# EAGLE schematic schematic (EAGLE 9.3.0)
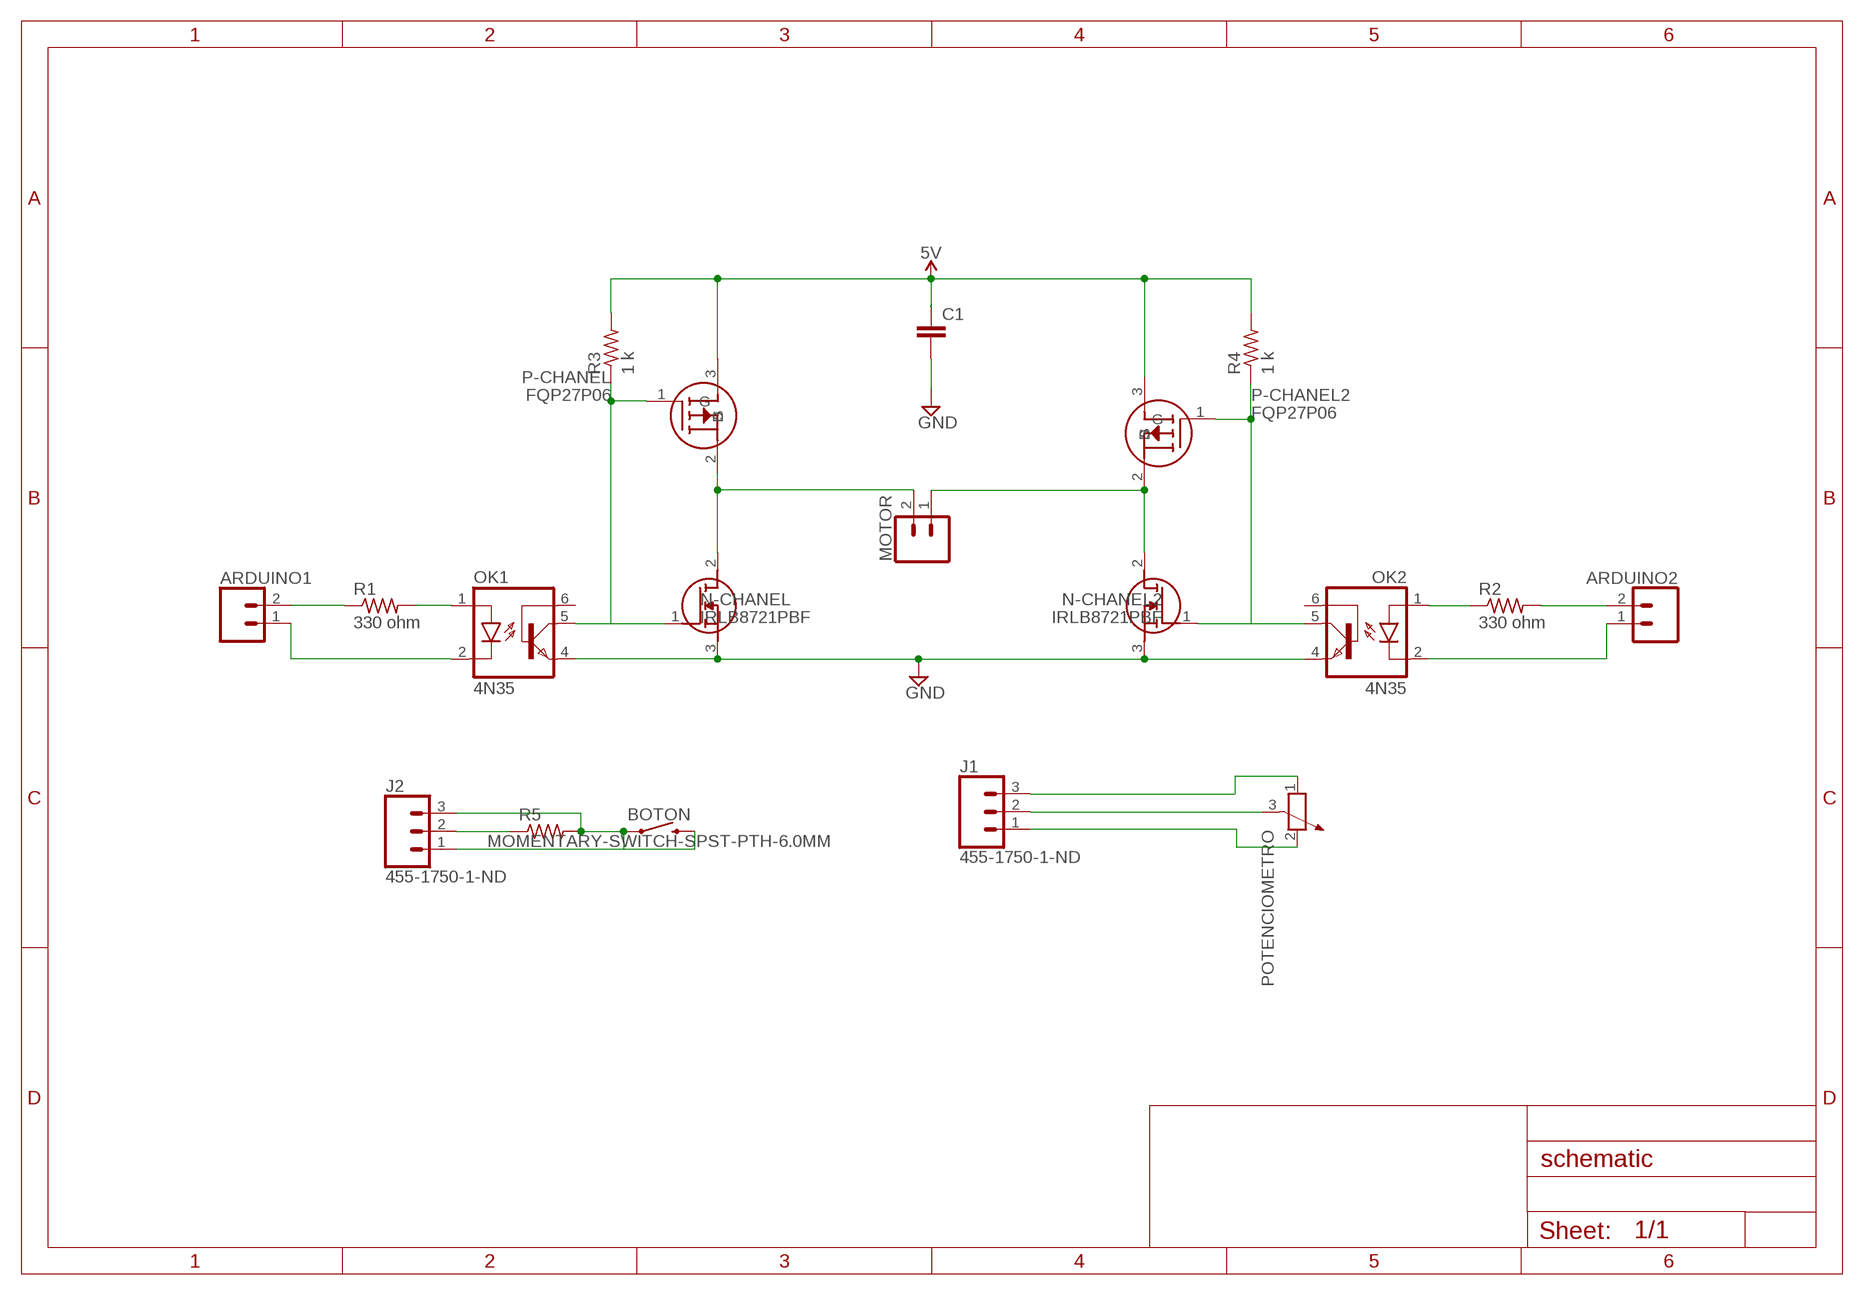
[diagram p0: schematic, sheet 1]

## Parts
ARDUINO1  CONN_02  [1X02]
ARDUINO2  CONN_02  [1X02]
BOTON  MOMENTARY-SWITCH-SPST-PTH-6.0MM  [TACTILE_SWITCH_PTH_6.0MM]
C1  C-EUC0805  [C0805]
J1  455-1750-1-ND  CONN_03  [1X03]
J2  455-1750-1-ND  CONN_03  [1X03]
MOTOR  CONN_02  [1X02]
N-CHANEL  IRLB8721PBF  [TO254P483X1016X1994-3P]
N-CHANEL2  IRLB8721PBF  [TO254P483X1016X1994-3P]
OK1  4N35  [DIL06]
OK2  4N35  [DIL06]
P-CHANEL  FQP27P06  [TO220]
P-CHANEL2  FQP27P06  [TO220]
POTENCIOMETRO  POTENTIOMETER_PT-10S  [PT-10S]
R1  330 ohm  R-US_0411/12  [0411/12]
R2  330 ohm  R-US_0411/12  [0411/12]
R3  1 k  R-US_0411/12  [0411/12]
R4  1 k  R-US_0411/12  [0411/12]
R5  R-US_0411/12  [0411/12]

## Nets
5V: C1.1 P-CHANEL2.3(S) P-CHANEL.3(S) R3.2 R4.2
GND: C1.2 N-CHANEL2.3(S) N-CHANEL.3(S) OK1.4(EMI) OK2.4(EMI)
N$1: MOTOR.2 N-CHANEL.2(D) P-CHANEL.2(D)
N$2: MOTOR.1 N-CHANEL2.2(D) P-CHANEL2.2(D)
N$3: N-CHANEL2.1(G) OK2.5(COL) P-CHANEL2.1(G) R4.1
N$4: OK1.1(A) R1.2
N$5: N-CHANEL.1(G) OK1.5(COL) P-CHANEL.1(G) R3.1
N$6: ARDUINO1.2 R1.1
N$7: ARDUINO1.1 OK1.2(C)
N$8: OK2.1(A) R2.1
N$9: ARDUINO2.2 R2.2
N$10: ARDUINO2.1 OK2.2(C)
N$11: J2.2 R5.1
N$12: J1.3 POTENCIOMETRO.1
N$13: J1.2 POTENCIOMETRO.3
N$14: J1.1 POTENCIOMETRO.2
N$15: BOTON.1 J2.3 R5.2
N$16: BOTON.3 J2.1
Unconnected: OK1.6(BAS) OK2.6(BAS)

## Library data of the parts
ARDUINO1 ARDUINO2 MOTOR = SparkFun-Connectors:CONN_02: Multi connection point. Often used as Generic Header-pin footprint for 0.1 inch spaced/style header connections On any of the 0.1 inch spaced packages, you can populate with these: Break Away Headers - Straight <https://www.sparkfun.com/products/116> (PRT-00116) Break Away Male Headers - Right Angle <https://www.sparkfun.com/products/553> (PRT-00553) Female Headers <https://www.sparkfun.com/products/115> (PRT-00115) Break Away Headers - Machine Pin <https://www.sparkfun.com/products/117> (PRT-00117) Break Away Female Headers - Swiss Machine Pin <https://www.sparkfun.com/products/743> (PRT-00743) For SCREWTERMINALS and SPRING TERMINALS visit here: Screw Terimnals on SparkFun.com <https://www.sparkfun.com/search/results?term=Screw+Terminals> (5mm/3.5mm/2.54mm spacing) This device is also useful as a general connection point to wire up your design to another part of your project. Our various solder wires solder well into these plated through hole pads. Hook-Up Wire - Assortment (Stranded, 22 AWG) <https://www.sparkfun.com/products/11375> (PRT-11375) Hook-Up Wire - Assortment (Solid Core, 22 AWG) <https://www.sparkfun.com/products/11367> (PRT-11367) View the entire wire category on our website here <https://www.sparkfun.com/categories/141> Special notes: Molex polarized connector foot print use with: PRT-08233 with associated crimp pins and housings. 2.54_SCREWTERM for use with PRT-10571. 3.5mm Screw Terminal footprints for PRT-08084 5mm Screw Terminal footprints for use with PRT-08432
BOTON = SparkFun-Switches:MOMENTARY-SWITCH-SPST: Momentary Switch (Pushbutton) - SPST Normally-open (NO) SPST momentary switches (buttons, pushbuttons). Variants PTH-12MM - 12mm square, through-hole Momentary Pushbutton Switch - 12mm Square <https://www.sparkfun.com/products/9190> (COM-09190) PTH-6.0MM, PTH-6.0MM-KIT - 6.0mm square, through-hole Mini Pushbutton Switch <https://www.sparkfun.com/products/97> (COM-00097) KIT package intended for soldering kit's - only one side of pads' copper is exposed. PTH-RIGHT-ANGLE-KIT - Right-angle, through-hole Right Angle Tactile Button <https://www.sparkfun.com/products/10791> - Used on SparkFun BigTime Watch Kit <https://www.sparkfun.com/products/11734> SMD-12MM - 12mm square, surface-mount Tactile Button - SMD (12mm) <https://www.sparkfun.com/products/12993> (COM-12993) Used on SparkFun PicoBoard <https://www.sparkfun.com/products/11888> SMD-4.5MM - 4.5mm Square Trackball Switch Used on SparkFun Blackberry Trackballer Breakout <https://www.sparkfun.com/products/13169> SMD-4.6MMX2.8MM - 4.60mm x 2.80mm, surface mount Used on SparkFun SAMD21 Mini Breakout <https://www.sparkfun.com/products/13664> SMD-5.2MM, SMD-5.2-REDUNDANT - 5.2mm square, surface-mount Mini Pushbutton Switch - SMD <https://www.sparkfun.com/products/8720> (COM-08720) Used on Arduino Pro Mini <https://www.sparkfun.com/products/11114> REDUNDANT package connects both switch circuits together SMD-6.0X3.5MM - 6.0 x 3.5mm, surface mount Momentary Reset Switch SMD <https://www.sparkfun.com/products/8229> (COM-08229) SMD-6.2MM-TALL - 6.2mm square, surface mount Tactile Button - SMD (6mm) <https://www.sparkfun.com/products/12992> Used on SparkFun Digital Sandbox <https://www.sparkfun.com/products/12651> SMD-RIGHT-ANGLE - Right-angle, surface mount Used on SparkFun Block for Intel® Edison - Arduino <https://www.sparkfun.com/products/13036>; PROD_ID: SWCH-08441; SF_SKU: COM-00097
C1 = rcl:C-EU: CAPACITOR, European symbol; SPICEPREFIX: C
J1 J2 = SparkFun-Connectors:CONN_03: Multi connection point. Often used as Generic Header-pin footprint for 0.1 inch spaced/style header connections On any of the 0.1 inch spaced packages, you can populate with these: Break Away Headers - Straight <https://www.sparkfun.com/products/116> (PRT-00116) Break Away Male Headers - Right Angle <https://www.sparkfun.com/products/553> (PRT-00553) Female Headers <https://www.sparkfun.com/products/115> (PRT-00115) Break Away Headers - Machine Pin <https://www.sparkfun.com/products/117> (PRT-00117) Break Away Female Headers - Swiss Machine Pin <https://www.sparkfun.com/products/743> (PRT-00743) Stackable Header - 3 Pin (Female, 0.1") <https://www.sparkfun.com/products/13875> (PRT-13875) For SCREWTERMINALS and SPRING TERMINALS visit here: Screw Terimnals on SparkFun.com <https://www.sparkfun.com/search/results?term=Screw+Terminals> (5mm/3.5mm/2.54mm spacing) This device is also useful as a general connection point to wire up your design to another part of your project. Our various solder wires solder well into these plated through hole pads. Hook-Up Wire - Assortment (Stranded, 22 AWG) <https://www.sparkfun.com/products/11375> (PRT-11375) Hook-Up Wire - Assortment (Solid Core, 22 AWG) <https://www.sparkfun.com/products/11367> (PRT-11367) View the entire wire category on our website here <https://www.sparkfun.com/categories/141> Special notes: Molex polarized connector foot print use with SKU : PRT-08232 with associated crimp pins and housings.; PROD_ID: XXX-00000
N-CHANEL N-CHANEL2 = IRLB8721PBF:IRLB8721PBF: Infineon IRLB8721PBF N-Channel MOSFET, 62 A, 30 V HEXFET, 3-Pin TO-220AB Source: Datasheet <http://uk.rs-online.com/web/p/products/7259322>; DESCRIPTION: Infineon IRLB8721PBF N-Channel MOSFET, 62 A, 30 V HEXFET, 3-Pin TO-220AB; HEIGHT: 4.83mm; MANUFACTURER_NAME: Infineon; MANUFACTURER_PART_NUMBER: IRLB8721PBF; MOUSER_PART_NUMBER: 942-IRLB8721PBF; MOUSER_PRICE-STOCK: https://www.mouser.com/Search/Refine.aspx?Keyword=942-IRLB8721PBF; RS_PART_NUMBER: 7259322P; RS_PRICE-STOCK: http://uk.rs-online.com/web/p/products/7259322P
OK1 OK2 = optocoupler:4N35: MOTOROLA OPTO COUPLER; MF: FAIRCHILD SEMICONDUCTOR; MPN: 4N35; OC_FARNELL: 1328375; OC_NEWARK: 72K9946
P-CHANEL P-CHANEL2 = FQP27P06:FQP27P06
POTENCIOMETRO = rcl:POTENTIOMETER_: Potentiometer; SPICEMODEL: POT; SPICEPREFIX: X
R1-R5 = rcl:R-US_: RESISTOR, American symbol